# Altium schematic sheet MiniGen.SchDoc: MiniGen
size 270 x 210 mm; Date: 2014-05-06 1:09:16 PM; SheetNumber: 1; Origin: Eagle; GateName_1: G$1; SymbolName_1: LETTER_L; LibraryName: SparkFun-Aesthetics; DeviceSetName: FRAME-LETTER; GateName_2: G$2; SymbolName_2: DOCFIELD; Sheet: Sheet:; REV: REV:; ReleasedundertheCreativeCommons: Released under the Creative Commons; AttributionShare-Alike3.0License: Attribution Share-Alike 3.0 License; http://creativecommons.org/licenses/by-sa/3.0: http://creativecommons.org/licenses/by-sa/3.0; Designby: Design by:
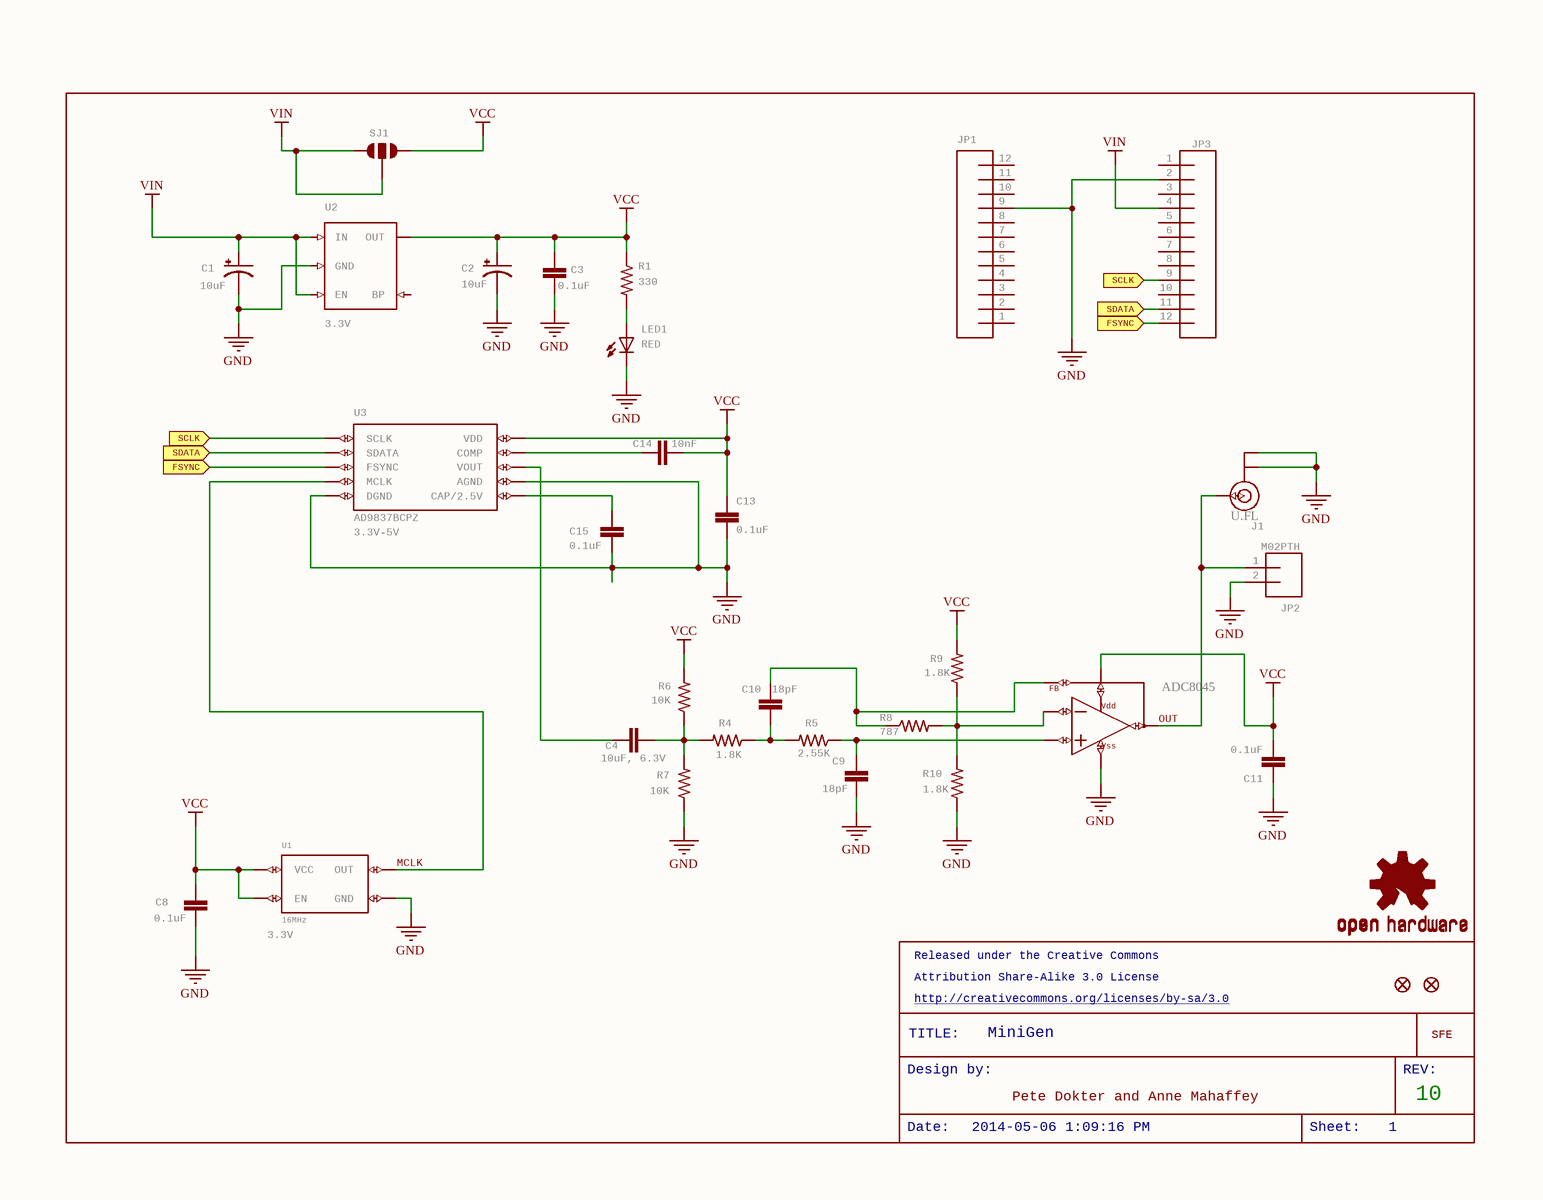
[diagram p0: MiniGen.SchDoc]

## Parts
C1  10uF  [EIA3528]
C2  10uF  [EIA3528]
C3  0.1uF  [0603-CAP]
C4  10uF, 6.3V  [0603-CAP]
C8  0.1uF  [0603-CAP]
C9  18pF  [0603-CAP]
C10  18pF  [0603-CAP]
C11  0.1uF  [0603-CAP]
C13  0.1uF  [0603-CAP]
C14  10nF  [0603-CAP]
C15  0.1uF  [0603-CAP]
FID1  FIDUCIAL1X2  [FIDUCIAL-1X2]  (value not drawn)
FID2  FIDUCIAL1X2  [FIDUCIAL-1X2]  (value not drawn)
J1  U.FL  [U.FL]
JP1  M12PTH  [1X12]  (value not drawn)
JP2  M02PTH  [1X02]
JP3  M12PTH  [1X12]  (value not drawn)
JP4  LOGO-SFENEW  [SFE-NEW-WEBLOGO]  (value not drawn)
LED1  RED  [LED-0603]
R1  330  [0603-RES]
R4  1.8K  [0603-RES]
R5  2.55K  [0603-RES]
R6  10K  [0603-RES]
R7  10K  [0603-RES]
R8  787  [0603-RES]
R9  1.8K  [0603-RES]
R10  1.8K  [0603-RES]
SJ1  SOLDERJUMPER_2WAYT  [SJ_2]  (value not drawn)
U1  16MHz  [CRYSTAL-SMD-7X5]
U2  3.3V  [SOT23-5]
U3  AD9837BCPZ  [AD9837]
U4  ADC8045  [SO08]
U$2  OSHW-LOGOS  [OSHW-LOGO-S]  (value not drawn)

## Ports
FSYNC (in), SCLK (in), SDATA (in)

## Nets
GND: C1.C(-) C2.C(-) C3.2 C8.2 C9.1 C11.1 C13.2 C15.2 J1.P$1(GND) J1.P$2(GND) JP1.9 JP2.2 JP3.2 LED1.C R7.1 R10.1 U1.P$2(GND) U2.2(GND) U3.P$0_P$4(DGND) U3.P$9(AGND) U4.4(VSS)
VCC: C2.A(+) C3.1 C8.1 C11.2 C13.1 C14.2 R1.1 R6.2 R9.2 SJ1.3 U1.P$1(EN) U1.P$4(VCC) U2.5(OUT) U3.P$2(VDD) U4.7(VDD)
VIN: C1.A(+) JP3.4 SJ1.1 SJ1.2 U2.1(IN) U2.3(EN)
FSYNC: JP3.12 U3.P$8(FSYNC) ; port FSYNC
MCLK: U1.P$3(OUT) U3.P$5(MCLK)
OUT: J1.P$3(SIGNAL) JP2.1 U4.6(OUT)
SCLK: JP3.9 U3.P$7(SCLK) ; port SCLK
SDATA: JP3.11 U3.P$6(SDATA) ; port SDATA
NetC4_1: C4.1 U3.P$10(VOUT)
NetC4_2: C4.2 R4.2 R6.1 R7.2
NetC9_2: C9.2 R5.1 U4.3(IN+)
NetC10_1: C10.1 R4.1 R5.2
NetC10_2: C10.2 R8.1 U4.1(FB)
NetC14_1: C14.1 U3.P$1(COMP)
NetC15_1: C15.1 U3.P$3(CAP/2.5V)
NetLED1_A: LED1.A R1.2
NetR8_2: R8.2 R9.1 R10.2 U4.2(IN-)

Not connected (* = marked no-connect by the designer): JP1 1 2 3 4 5 6 7 8 10 11 12; JP3 1 3 5 6 7 8 10; U2 4(BP)

## Notes on the sheet
- (near U3) 3.3V-5V
- (near U1) 3.3V
- Released under the Creative Commons
- Attribution Share-Alike 3.0 License
- http://creativecommons.org/licenses/by-sa/3.0
- Design by:
- TITLE:
- MiniGen
- (near JP4) REV:
- Date:
- 2014-05-06 1:09:16 PM
- Pete Dokter and Anne Mahaffey
- Sheet:
- 1
- (near JP4) 10

## Library data of the parts
C1 C2 = 10UF-20V-10%(TANT): CAP-08063; GateName_1: G$1; SymbolName_1: CAP_POL; LibraryName: SparkFun-Capacitors; DeviceSetName: 10UF-20V-10%(TANT); PROD_ID: CAP-08063
C3 C8 C11 C13 C15 = 0.1UF-25V(+80/-20%)(0603): CAP-00810 Ceramic Standard decoupling cap; GateName_1: G$1; SymbolName_1: CAP; LibraryName: SparkFun-Capacitors; DeviceSetName: 0.1UF-25V(+80/-20%)(0603); PROD_ID: CAP-00810
C4 = 10UF-6.3V-20%(0603): CAP-11015; GateName_1: G$1; SymbolName_1: CAP; LibraryName: SparkFun-Capacitors; DeviceSetName: 10UF-6.3V-20%(0603); PROD_ID: CAP-11015
C9 C10 = 18PF-50V-5%(0603): CAP-08267; GateName_1: G$1; SymbolName_1: CAP; LibraryName: SparkFun-Capacitors; DeviceSetName: 18PF-50V-5%(0603); PROD_ID: CAP-08267
C14 = 10NF/10000PF-50V-10%(0603): CAP-00867; GateName_1: G$1; SymbolName_1: CAP; LibraryName: SparkFun-Capacitors; DeviceSetName: 10NF/10000PF-50V-10%(0603); PROD_ID: CAP-00867
FID1 FID2 = FIDUCIAL1X2: Fiducial Alignment PointsVarious fiducial points for machine vision alignment.; GateName_1: G$1; DeviceName: 1X2; SymbolName_1: FIDUCIAL; LibraryName: SparkFun-Aesthetics; DeviceSetName: FIDUCIAL
J1 = U.FL: SMD antenna connector- WRL-09144; GateName_1: G$1; PROD_ID: CONN-09193; SymbolName_1: U.FL; LibraryName: SparkFun-Connectors; DeviceSetName: U.FL
JP1 JP3 = M12PTH: Header 12Standard 12-pin 0.1" header. Use with straight break away headers (SKU : PRT-00116), right angle break away headers (PRT-00553), swiss pins (PRT-00743), machine pins (PRT-00117), and female headers (PRT-00115).; GateName_1: G$1; SymbolName_1: M12; DeviceName: PTH; LibraryName: SparkFun-Connectors; DeviceSetName: M12
JP2 = M02PTH: Standard 2-pin 0.1" header. Use with  - straight break away headers ( PRT-00116) - right angle break away headers (PRT-00553) - swiss pins (PRT-00743) - machine pins (PRT-00117) - female headers (PRT-00115)   Molex polarized connector foot print use with: PRT-08233 with associated crimp pins and housings.  2.54_SCREWTERM for use with  PRT-10571.  3.5mm Screw Terminal footprints for  PRT-08084  5mm Screw Terminal footprints for use with PRT-08433; GateName_1: G$1; SymbolName_1: M02; DeviceName: PTH; LibraryName: SparkFun-Connectors; DeviceSetName: M02
JP4 = LOGO-SFENEW: Spark Fun Electronics PCB LogoThis is the standard Spark Fun Electronics PCB logo.; GateName_1: G$1; SymbolName_1: LOGO1; DeviceName: NEW; LibraryName: SparkFun-Aesthetics; DeviceSetName: LOGO-SFE; SFE: SFE
LED1 = LED-RED0603: Assorted Red LEDs LilyPad 1206- DIO-09912 1206- DIO-00809 0603- DIO-00819; GateName_1: G$1; SymbolName_1: LED; DeviceName: 0603; LibraryName: SparkFun-LED; DeviceSetName: LED-RED; PROD_ID: DIO-00819
R1 = 330OHM1/10W1%(0603): RES-00818; GateName_1: G$1; SymbolName_1: RESISTOR; LibraryName: SparkFun-Resistors; DeviceSetName: 330OHM1/10W1%(0603); PROD_ID: RES-00818
R4 R9 R10 = 1.8KOHM1/10W1%(0603): RES-09119; GateName_1: G$1; SymbolName_1: RESISTOR; LibraryName: SparkFun-Resistors; DeviceSetName: 1.8KOHM1/10W1%(0603); PROD_ID: RES-09119
R5 = 2.55KOHM-1/10W-1%(0603): RES-11227; GateName_1: G$1; SymbolName_1: RESISTOR; LibraryName: SparkFun-Resistors; DeviceSetName: 2.55KOHM-1/10W-1%(0603); PROD_ID: RES-11227
R6 R7 = 10KOHM1/10W1%(0603)0603: RES-00824; GateName_1: G$1; SymbolName_1: RESISTOR; DeviceName: 0603; LibraryName: SparkFun-Resistors; DeviceSetName: 10KOHM1/10W1%(0603); PROD_ID: RES-00824
R8 = 787-1%: 787-ohm SMT 1/10W - 1% (0603) RES-11228; GateName_1: G$1; SymbolName_1: RESISTOR; LibraryName: SparkFun-Resistors; DeviceSetName: 787-1%; PROD_ID: RES-11228
SJ1 = SOLDERJUMPER_2WAYT: Solder Jumper2 way solder jumper; GateName_1: G$1; DeviceName: T; SymbolName_1: SJ_2; LibraryName: SparkFun-Passives; DeviceSetName: SOLDERJUMPER_2WAY
U1 = OSCILLATORXTAL-11225: Generic 5x3 and 7x5 oscillators; GateName_1: G$1; SymbolName_1: OSCILLATOR; DeviceName: XTAL-11225; LibraryName: SparkFun-FreqCtrl; DeviceSetName: OSCILLATOR; PROD_ID: XTAL-11225
U2 = MIC52053.3V: MIC5205 150mA vreg 3.3V - VREG-00822 5V - VREG-00823; GateName_1: G$1; SymbolName_1: V-REG-LDO; DeviceName: 3.3V; LibraryName: SparkFun-PowerIC; DeviceSetName: MIC5205; PROD_ID: VREG-00822
U3 = AD9837: Programmable waveform generator, sine, triangular, and square wave outputs.; GateName_1: G1; PROD_ID: IC-11223; SymbolName_1: AD9837; LibraryName: SparkFun-AnalogIC; DeviceSetName: AD9837
U4 = ADC8045: Unity-gain stable feedback amplifier. Low noise, low distortion, 1GHz BW.; GateName_1: G$1; PROD_ID: IC-11224; SymbolName_1: ADC8045; LibraryName: SparkFun-AnalogIC; DeviceSetName: ADC8045; Vss: Vss; Vdd: Vdd; FB: FB
U$2 = OSHW-LOGOS: Open Source Hardware Logo This logo indicates the piece of hardware it is found on incorporates a OSHW license and/or adheres to the definition of open source hardware found here: http://freedomdefined.org/OSHW; GateName_1: G$1; DeviceName: S; SymbolName_1: OSHW-LOGO; LibraryName: SparkFun-Aesthetics; DeviceSetName: OSHW-LOGO